# Altium schematic sheet 智能开关.SchDoc
size A3
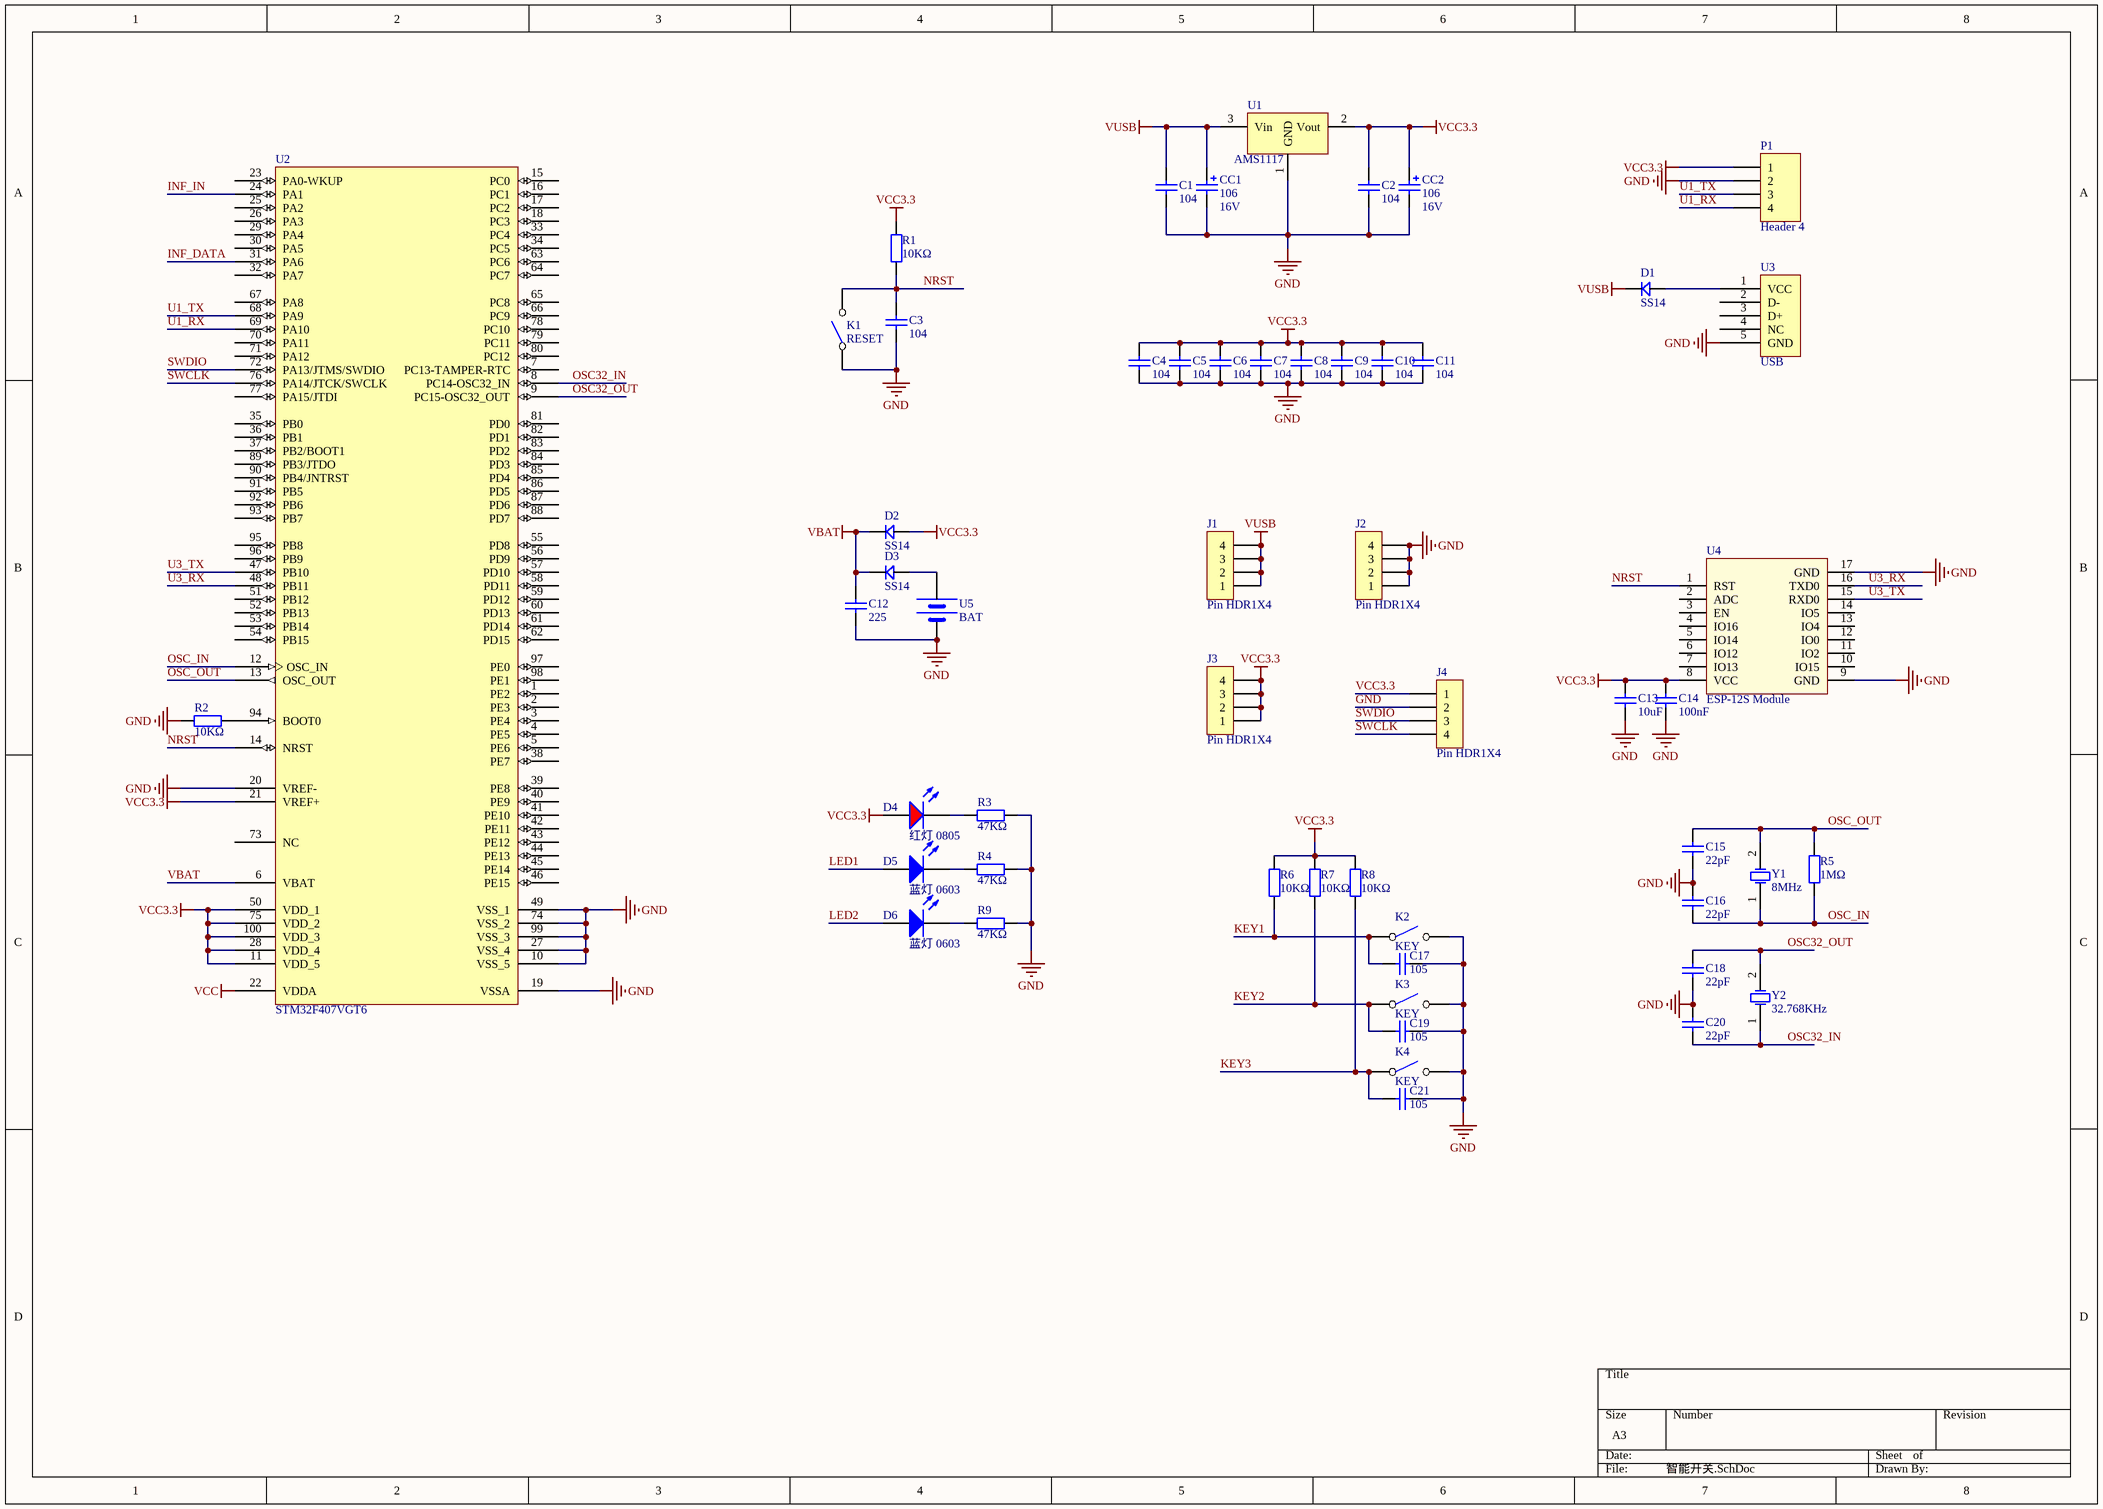
[diagram p0: 智能开关.SchDoc]

## Parts
C1  104  [LC-0805_C]
C2  104  [LC-0805_C]
C3  104  [LC-0805_C]
C4  104  [LC-0805_C]
C5  104  [LC-0805_C]
C6  104  [LC-0805_C]
C7  104  [LC-0805_C]
C8  104  [LC-0805_C]
C9  104  [LC-0805_C]
C10  104  [LC-0805_C]
C11  104  [LC-0805_C]
C12  225  [LC-0805_C]
C13  10uF  [LC-0805_C]
C14  100nF  [LC-0805_C]
C15  22pF  [LC-0805_C]
C16  22pF  [LC-0805_C]
C17  105  [LC-0805_C]
C18  22pF  [LC-0805_C]
C19  105  [LC-0805_C]
C20  22pF  [LC-0805_C]
C21  105  [LC-0805_C]
CC1  Capacitance: 106  Voltage: 16V  [TAN-C-6032]  (hidden comment: Cap Tan C)
CC2  Capacitance: 106  Voltage: 16V  [TAN-C-6032]  (hidden comment: Cap Tan C)
D1  SS14  [LC-SOD-123]
D2  SS14  [LC-SOD-123]
D3  SS14  [LC-SOD-123]
D4  红灯 0805  [LC-0805_LED_S1]
D5  蓝灯 0603  [LC-0805_LED_S1]
D6  蓝灯 0603  [LC-0805_LED_S1]
J1  Pin HDR1X4  [Pin HDR1X4/2.54mm-S]
J2  Pin HDR1X4  [Pin HDR1X4/2.54mm-S]
J3  Pin HDR1X4  [Pin HDR1X4/2.54mm-S]
J4  Pin HDR1X4  [Pin HDR1X4/2.54mm-S]
K1  RESET  [KEY_2]
K2  KEY  [KEY_2]
K3  KEY  [KEY_2]
K4  KEY  [KEY_2]
P1  Header 4  [HDR1X4]
R1  10KΩ  [LC-0805_R]
R2  10KΩ  [LC-0805_R]
R3  47KΩ  [LC-0805_R]
R4  47KΩ  [LC-0805_R]
R5  1MΩ  [LC-0805_R]
R6  10KΩ  [LC-0805_R]
R7  10KΩ  [LC-0805_R]
R8  10KΩ  [LC-0805_R]
R9  47KΩ  [LC-0805_R]
U1  AMS1117  [SOT-223]
U2  STM32F407VGT6  [LQFP100 14x14]
U3  USB  [USB_B]
U4  ESP-12S Module  [ESP-12S Module]
U5  BAT  [CR1220_A]
Y1  8MHz  [XTAL-SMD]
Y2  32.768KHz  [OSC-3x8-WI-B]

## Nets
GND: C1.1 C2.1 C3.1 C4.1 C5.1 C6.1 C7.1 C8.1 C9.1 C10.1 C11.1 C12.1 C13.1 C14.1 C15.1 C16.2 C17.2 C18.1 C19.2 C20.2 C21.2 CC1.1 CC2.1 J2.1 J2.2 J2.3 J2.4 J4.2 K1.1 K2.2 K3.2 K4.2 P1.2 R2.1 R3.2 R4.2 R9.2 U1.1(GND) U2.10(VSS_5) U2.19(VSSA) U2.20(VREF-) U2.27(VSS_4) U2.49(VSS_1) U2.74(VSS_2) U2.99(VSS_3) U3.5(GND) U4.9(GND) U4.17(GND) U5.2(GND)
VBAT: C12.2 D2.2 D3.2 U2.6(VBAT)
VCC: U2.22(VDDA)
VCC3.3: C2.2 C4.2 C5.2 C6.2 C7.2 C8.2 C9.2 C10.2 C11.2 C13.2 C14.2 CC2.2 D2.1 D4.A J3.1 J3.2 J3.3 J3.4 J4.1 P1.1 R1.2 R6.2 R7.2 R8.2 U1.2(Vout) U2.11(VDD_5) U2.21(VREF+) U2.28(VDD_4) U2.50(VDD_1) U2.75(VDD_2) U2.100(VDD_3) U4.8(VCC)
VUSB: C1.2 CC1.2 D1.2 J1.1 J1.2 J1.3 J1.4 U1.3(Vin)
INF_DATA: U2.31(PA6)
INF_IN: U2.24(PA1)
KEY1: C17.1 K2.1 R6.1
KEY2: C19.1 K3.1 R7.1
KEY3: C21.1 K4.1 R8.1
LED1: D5.A
LED2: D6.A
NRST: C3.2 K1.2 R1.1 U2.14(NRST) U4.1(RST)
OSC32_IN: C20.1 U2.8(PC14-OSC32_IN) Y2.1(OSC1)
OSC32_OUT: C18.2 U2.9(PC15-OSC32_OUT) Y2.2(OSC2)
OSC_IN: C16.1 R5.1 U2.12(OSC_IN) Y1.1(OSC1)
OSC_OUT: C15.2 R5.2 U2.13(OSC_OUT) Y1.2(OSC2)
SWCLK: J4.4 U2.76(PA14/JTCK/SWCLK)
SWDIO: J4.3 U2.72(PA13/JTMS/SWDIO)
U1_RX: P1.4 U2.69(PA10)
U1_TX: P1.3 U2.68(PA9)
U3_RX: U2.48(PB11) U4.16(TXD0)
U3_TX: U2.47(PB10) U4.15(RXD0)
NetD1_1: D1.1 U3.1(VCC)
NetD3_1: D3.1 U5.1(VCC)
NetD4_K: D4.K R3.1
NetD5_K: D5.K R4.1
NetD6_K: D6.K R9.1
NetR2_2: R2.2 U2.94(BOOT0)

Not connected (* = marked no-connect by the designer): U2 1(PE2) 2(PE3) 3(PE4) 4(PE5) 5(PE6) 7(PC13-TAMPER-RTC) 15(PC0) 16(PC1) 17(PC2) 18(PC3) 23(PA0-WKUP) 25(PA2) 26(PA3) 29(PA4) 30(PA5) 32(PA7) 33(PC4) 34(PC5) 35(PB0) 36(PB1) 37(PB2/BOOT1) 38(PE7) 39(PE8) 40(PE9) 41(PE10) 42(PE11) 43(PE12) 44(PE13) 45(PE14) 46(PE15) 51(PB12) 52(PB13) 53(PB14) 54(PB15) 55(PD8) 56(PD9) 57(PD10) 58(PD11) 59(PD12) 60(PD13) 61(PD14) 62(PD15) 63(PC6) 64(PC7) 65(PC8) 66(PC9) 67(PA8) 70(PA11) 71(PA12) 73(NC) 77(PA15/JTDI) 78(PC10) 79(PC11) 80(PC12) 81(PD0) 82(PD1) 83(PD2) 84(PD3) 85(PD4) 86(PD5) 87(PD6) 88(PD7) 89(PB3/JTDO) 90(PB4/JNTRST) 91(PB5) 92(PB6) 93(PB7) 95(PB8) 96(PB9) 97(PE0) 98(PE1); U3 2(D-) 3(D+) 4(NC); U4 2(ADC) 3(EN) 4(IO16) 5(IO14) 6(IO12) 7(IO13) 10(IO15) 11(IO2) 12(IO0) 13(IO4) 14(IO5)

## Library data of the parts
C1 C2 C4-C14 C17 C19 C21 = 0805 6.8nF (682) 10% 50V: 贴片电容; ComponentLink1Description: 供应商链接; ComponentLink1URL: http://www.szlcsc.com/product/details_2107.html; Package: 0805; Supplier: LC; SuppliersPartNumber: C1755
C3 = 0805 330nF (334) 10% 50V: 贴片电容; ComponentLink1Description: 供应商链接; ComponentLink1URL: http://www.szlcsc.com/product/details_2092.html; Package: 0805; Supplier: LC; SuppliersPartNumber: C1740
C15 C16 C18 C20 = 0805 6pF (6R0) 0.25pF 50V: 贴片电容; ComponentLink1Description: 供应商链接; ComponentLink1URL: http://www.szlcsc.com/product/details_68656.html; Package: 0805; Supplier: LC; SuppliersPartNumber: C67560
CC1 CC2 = Cap Tan C: Polarized Capacitor (Radial); Published: 8-Jun-2000; Revision: July-2002: Re-released for DXP Platform.; Publisher: Altium Limited
D1-D3 = D
D4 = 0805 红灯: 发光二极管; ComponentLink1Description: 供应商链接; ComponentLink1URL: http://www.szlcsc.com/product/details_2668.html; Package: 0805; Supplier: LC; SuppliersPartNumber: C2295
D5 D6 = 0603 蓝灯: 发光二极管; ComponentLink1Description: 供应商链接; ComponentLink1URL: http://www.szlcsc.com/product/details_73150.html; Package: 0603; Supplier: LC; SuppliersPartNumber: C72041
K1-K4 = KEY: 微动开关
P1 = Header 4: Header, 4-Pin; LatestRevisionDate: 17-Jul-2002; LatestRevisionNote: Re-released for DXP Platform.; Publisher: Altium Limited
R1 R5 = 0805 390KΩ (3903) 1%: 贴片电阻; ComponentLink1Description: 供应商链接; ComponentLink1URL: http://www.szlcsc.com/product/details_18344.html; Package: 0805; Supplier: LC; SuppliersPartNumber: C17656
R2 = 0805 1.8KΩ (1801) 1%: 贴片电阻; ComponentLink1Description: 供应商链接; ComponentLink1URL: http://www.szlcsc.com/product/details_18086.html; Package: 0805; Supplier: LC; SuppliersPartNumber: C17398
R3 R4 R6-R9 = 0805 11KΩ (1102) 1%: 贴片电阻; ComponentLink1Description: 供应商链接; ComponentLink1URL: http://www.szlcsc.com/product/details_18117.html; Package: 0805; Supplier: LC; SuppliersPartNumber: C17429
U1 = AMS1117: 3.3V电压转换器AMS1117
U2 = STM32F103VBT6: Published: *; DatasheetVersion: *; PackageVersion: *; PackageReference: *; Publisher: *; PackageDescription: *; ComponentLink1Description: *; ComponentLink1URL: *; ComponentLink2Description: *; ComponentLink2URL: *
U5 = BAT: 纽扣电池座CR1220
Y1 Y2 = XTAL: 晶体振荡器; Published: 8-Jun-2000; LatestRevisionDate: 17-Jul-2002; LatestRevisionNote: Re-released for DXP Platform.; PackageReference: R38; Publisher: Altium Limited